# EAGLE schematic CT_Metering_Assignment-V_33_error checked for online (EAGLE 8.2.2)
CT METERING SCHEMATIC
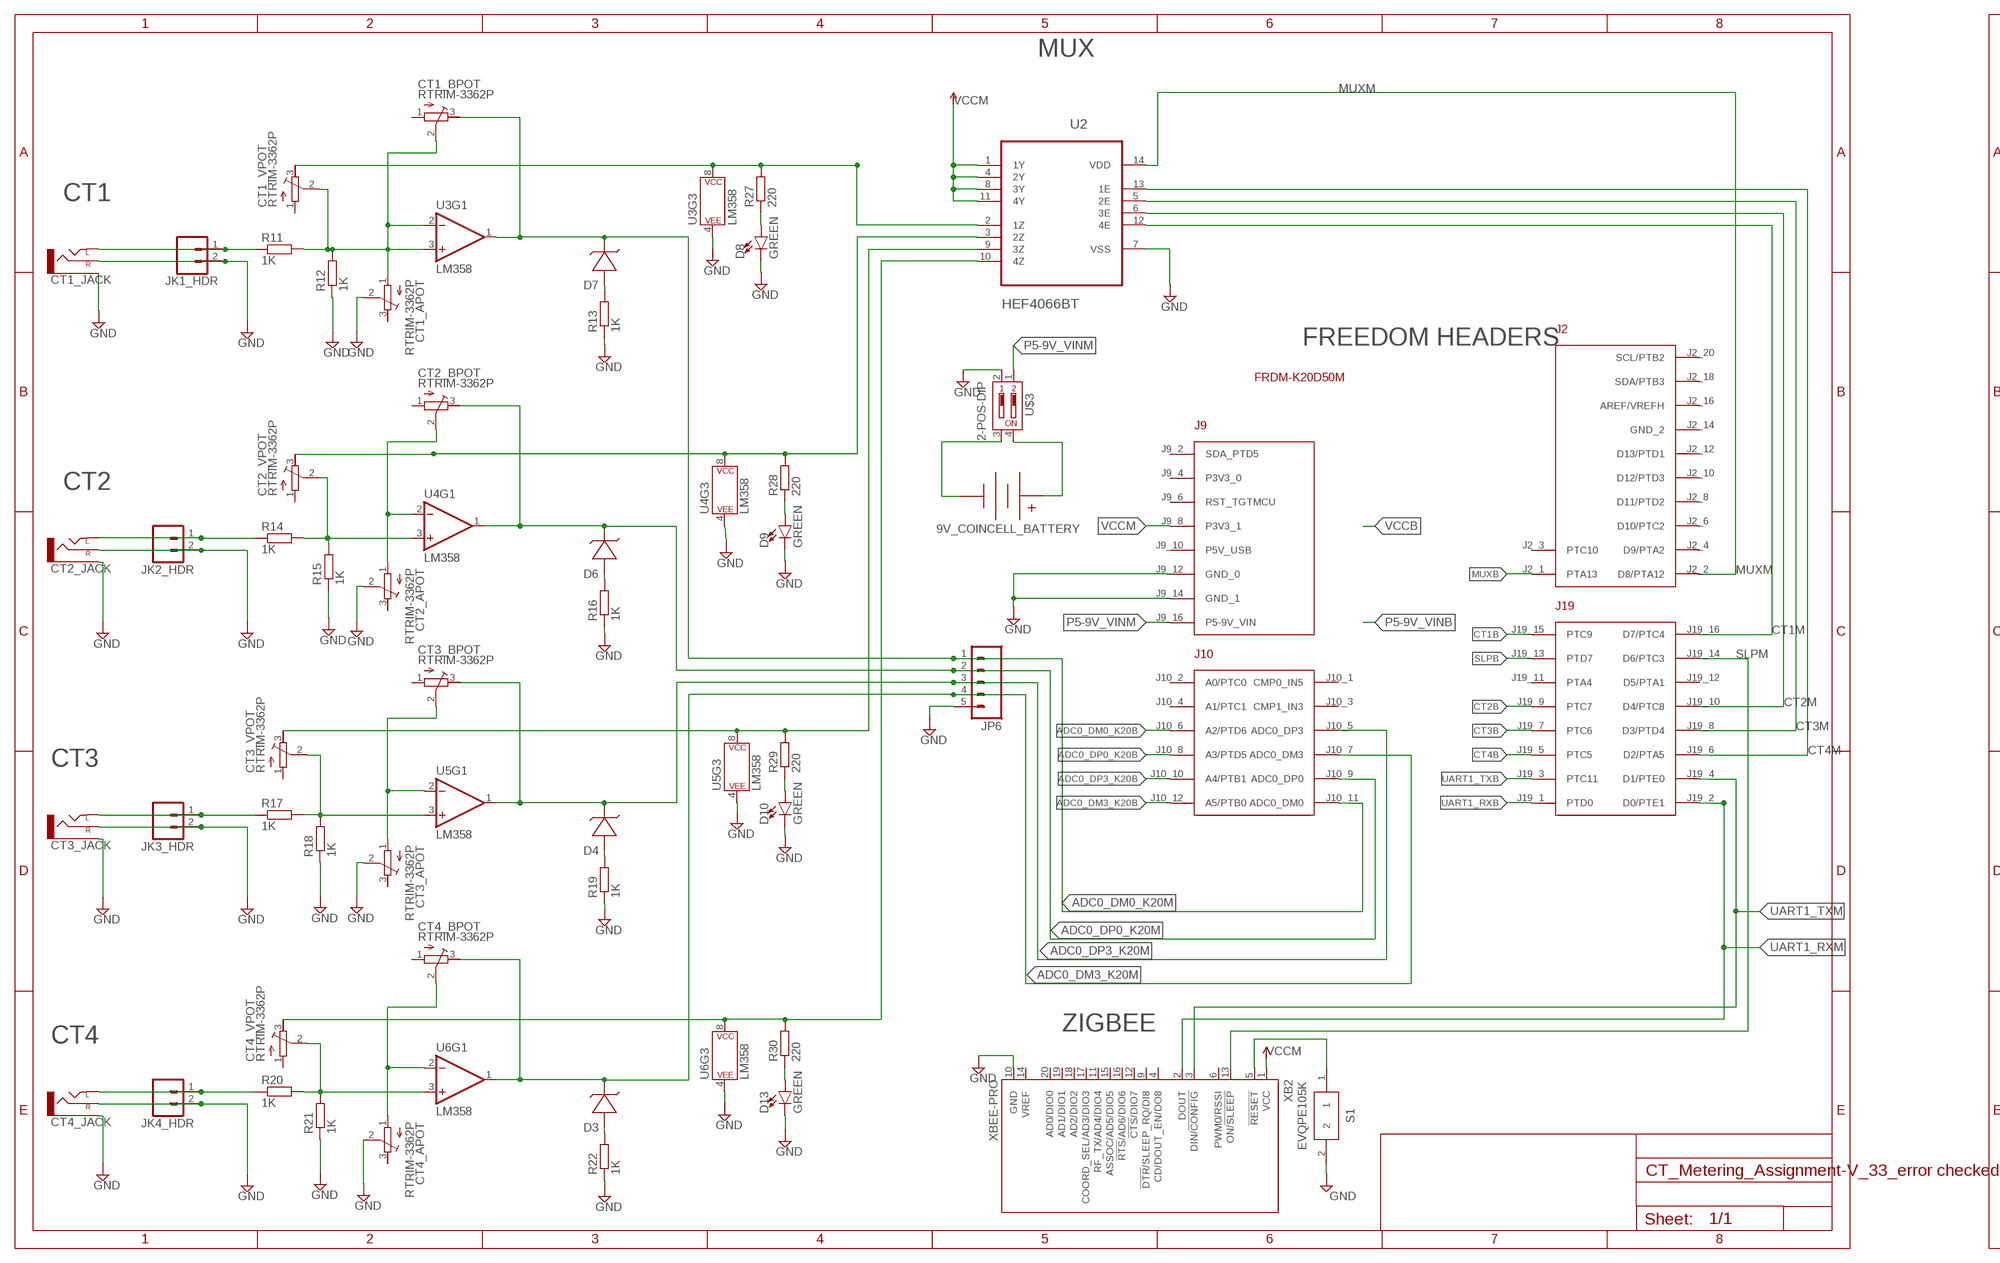
[diagram p0: schematic, sheet 1, part 1 of 2]
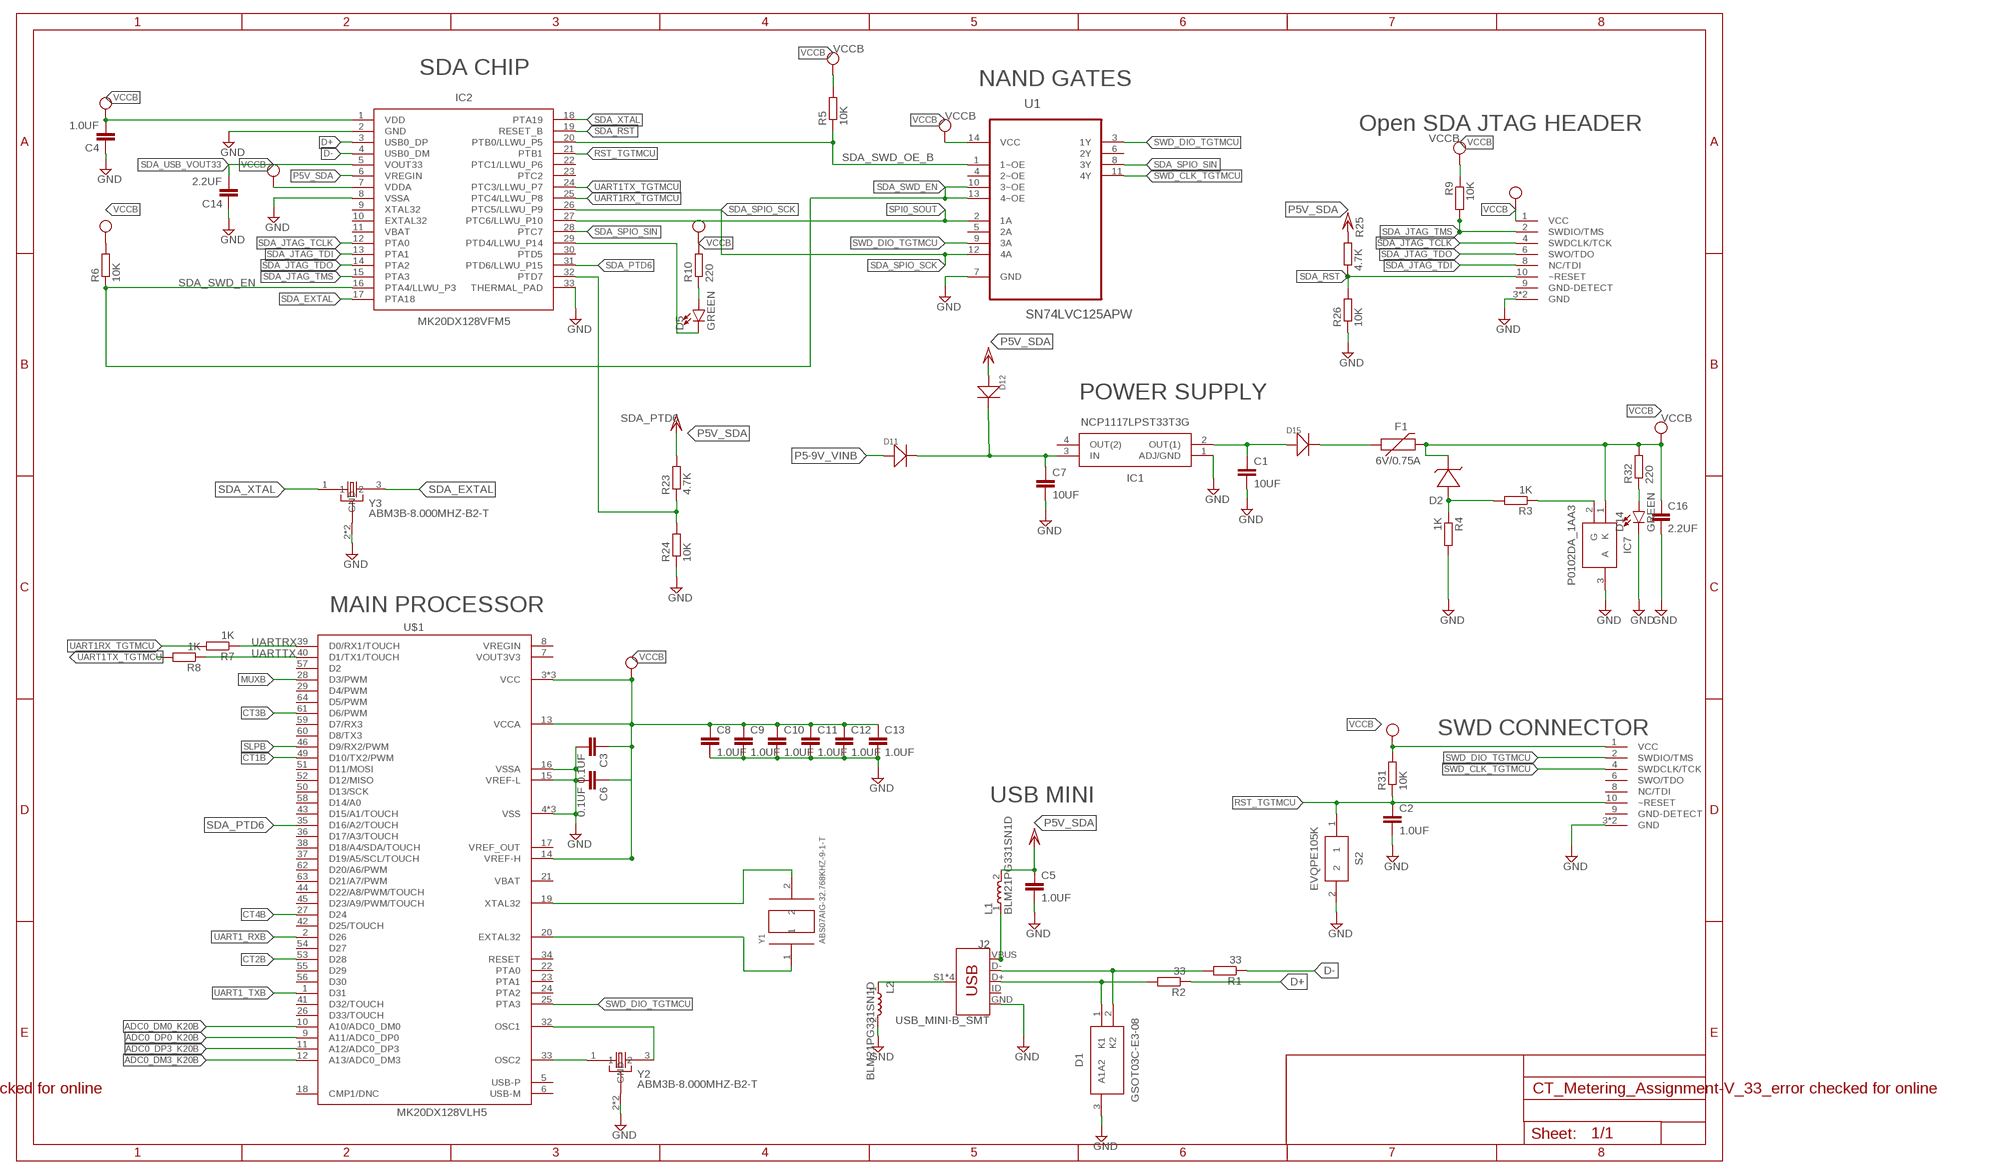
[diagram p1: schematic, sheet 1, part 2 of 2]
U$5 (FRAME-A3-L): AUTHORED: Mick Beans & Clinton

## Parts
9V_COINCELL_BATTERY  BC9VPC  [BC9VPC]
C1  10UF  CC1210  [C1210]
C2  1.0UF  CC1210  [C1210]
C3  0.1UF  CC1210  [C1210]
C4  1.0UF  CC1210  [C1210]
C5  1.0UF  CC1210  [C1210]
C6  0.1UF  CC1210  [C1210]
C7  10UF  CC1210  [C1210]
C8  1.0UF  CC1210  [C1210]
C9  1.0UF  CC1210  [C1210]
C10  1.0UF  CC1210  [C1210]
C11  1.0UF  CC1210  [C1210]
C12  1.0UF  CC1210  [C1210]
C13  1.0UF  CC1210  [C1210]
C14  2.2UF  CC1210  [C1210]
C16  2.2UF  CC1210  [C1210]
CT1_APOT  RTRIM-3362P  [RTRIM3362P]
CT1_BPOT  RTRIM-3362P  [RTRIM3362P]
CT1_JACK  AUDIO-JACKPTH  [AUDIO-JACK]
CT1_VPOT  RTRIM-3362P  [RTRIM3362P]
CT2_APOT  RTRIM-3362P  [RTRIM3362P]
CT2_BPOT  RTRIM-3362P  [RTRIM3362P]
CT2_JACK  AUDIO-JACKPTH  [AUDIO-JACK]
CT2_VPOT  RTRIM-3362P  [RTRIM3362P]
CT3_APOT  RTRIM-3362P  [RTRIM3362P]
CT3_BPOT  RTRIM-3362P  [RTRIM3362P]
CT3_JACK  AUDIO-JACKPTH  [AUDIO-JACK]
CT3_VPOT  RTRIM-3362P  [RTRIM3362P]
CT4_APOT  RTRIM-3362P  [RTRIM3362P]
CT4_BPOT  RTRIM-3362P  [RTRIM3362P]
CT4_JACK  AUDIO-JACKPTH  [AUDIO-JACK]
CT4_VPOT  RTRIM-3362P  [RTRIM3362P]
D1  GSOT03C-E3-08  [SOT100P248X115-3N]
D2  ZENER  [SOD123]
D3  ZENER  [SOD123]
D4  ZENER  [SOD123]
D5  GREEN  LED-GREEN0603  [LED-0603]
D6  ZENER  [SOD123]
D7  ZENER  [SOD123]
D8  GREEN  LED-GREEN0603  [LED-0603]
D9  GREEN  LED-GREEN0603  [LED-0603]
D10  GREEN  LED-GREEN0603  [LED-0603]
D11  20V-1A  SMD-DIODE-SCHOTTKY-20V-1A(SOD-123)  [SOD-123]
D12  20V-1A  SMD-DIODE-SCHOTTKY-20V-1A(SOD-123)  [SOD-123]
D13  GREEN  LED-GREEN0603  [LED-0603]
D14  GREEN  LED-GREEN0603  [LED-0603]
D15  20V-1A  SMD-DIODE-SCHOTTKY-20V-1A(SOD-123)  [SOD-123]
F1  6V/0.75A  PPTC_THREE-QUARTER-AMP  [1206]
FRDM1  FRDM-K20D50M  [FRDM-K20D50M]
IC1  NCP1117LPST33T3G  [SOT230P700X180-4N]
IC2  MK20DX128VFM5  [SOT617-14]
IC7  P0102DA_1AA3  [TO-92]
J2  USB_MINI-B_SMT  [USB-MINIB]
JK1_HDR  M02PTH  [1X02]
JK2_HDR  M02PTH  [1X02]
JK3_HDR  M02PTH  [1X02]
JK4_HDR  M02PTH  [1X02]
JP6  M05PTH  [1X05]
L1  BLM21PG331SN1D  [INDC2012X87]
L2  BLM21PG331SN1D  [INDC2012X87]
R1  33  R-EU_PRL1632  [PRL1632]
R2  33  R-EU_PRL1632  [PRL1632]
R3  1K  R-EU_PRL1632  [PRL1632]
R4  1K  R-EU_PRL1632  [PRL1632]
R5  10K  R-EU_PRL1632  [PRL1632]
R6  10K  R-EU_PRL1632  [PRL1632]
R7  1K  R-EU_PRL1632  [PRL1632]
R8  1K  R-EU_PRL1632  [PRL1632]
R9  10K  R-EU_PRL1632  [PRL1632]
R10  220  R-EU_PRL1632  [PRL1632]
R11  1K  R-EU_PRL1632  [PRL1632]
R12  1K  R-EU_PRL1632  [PRL1632]
R13  1K  R-EU_PRL1632  [PRL1632]
R14  1K  R-EU_PRL1632  [PRL1632]
R15  1K  R-EU_PRL1632  [PRL1632]
R16  1K  R-EU_PRL1632  [PRL1632]
R17  1K  R-EU_PRL1632  [PRL1632]
R18  1K  R-EU_PRL1632  [PRL1632]
R19  1K  R-EU_PRL1632  [PRL1632]
R20  1K  R-EU_PRL1632  [PRL1632]
R21  1K  R-EU_PRL1632  [PRL1632]
R22  1K  R-EU_PRL1632  [PRL1632]
R23  4.7K  R-EU_PRL1632  [PRL1632]
R24  10K  R-EU_PRL1632  [PRL1632]
R25  4.7K  R-EU_PRL1632  [PRL1632]
R26  10K  R-EU_PRL1632  [PRL1632]
R27  220  R-EU_PRL1632  [PRL1632]
R28  220  R-EU_PRL1632  [PRL1632]
R29  220  R-EU_PRL1632  [PRL1632]
R30  220  R-EU_PRL1632  [PRL1632]
R31  10K  R-EU_PRL1632  [PRL1632]
R32  220  R-EU_PRL1632  [PRL1632]
S1  EVQPE105K  [EVQPE1]
S2  EVQPE105K  [EVQPE1]
U1  SN74LVC125APW  [SOP65P640X120-14N]
U2  HEF4066BT  [SOIC127P600X175-14N]
U3  LM358  [DIP08]
U4  LM358  [DIP08]
U5  LM358  [DIP08]
U6  LM358  [DIP08]
U$1  MK20DX128VLH5  [QFP50P1200X1200X160-64N]
U$2  2X5_0.05"_CORTEX_DEBUGTH_NOKEY_UNSHROUDED  [2X5_0.05"_TH_NS]
U$3  2-POS-DIP  [CHS-02A]
U$6  SWD HHEADER  2X5_0.05"_CORTEX_DEBUGTH_NOKEY_UNSHROUDED  [2X5_0.05"_TH_NS]
XB2  XBEE-PRO  [XBEE-PRO]
Y1  ABS07AIG-32.768KHZ-9-1-T  [XTAL320X150X90]
Y2  ABM3B-8.000MHZ-B2-T  [OSCSC500X320X110-4N]
Y3  ABM3B-8.000MHZ-B2-T  [OSCSC500X320X110-4N]

## Nets
ADC0_DM0_K20B: FRDM1.J10_6(A2/PTD6) U$1.10(A10/ADC0_DM0)
ADC0_DM0_K20M: CT1_BPOT.3 D7.C(-) FRDM1.J10_11(ADC0_DM0) JP6.1 U3.1(OUT)
ADC0_DM3_K20B: FRDM1.J10_12(A5/PTB0) U$1.12(A13/ADC0_DM3)
ADC0_DM3_K20M: CT4_BPOT.3 D3.C(-) FRDM1.J10_7(ADC0_DM3) JP6.4 U6.1(OUT)
ADC0_DP0_K20B: FRDM1.J10_8(A3/PTD5) U$1.9(A11/ADC0_DP0)
ADC0_DP0_K20M: CT2_BPOT.3 D6.C(-) FRDM1.J10_9(ADC0_DP0) JP6.2 U4.1(OUT)
ADC0_DP3_K20B: FRDM1.J10_10(A4/PTB1) U$1.11(A12/ADC0_DP3)
ADC0_DP3_K20M: CT3_BPOT.3 D4.C(-) FRDM1.J10_5(ADC0_DP3) JP6.3 U5.1(OUT)
CT1_PWR: CT1_VPOT.3 R27.2 U2.2(1Z) U3.8(P$V+)
CT1B: FRDM1.J19_15(PTC9) U$1.49(D10/TX2/PWM)
CT1M: FRDM1.J19_16(D7/PTC4) U2.12(4E)
CT2_PWR: CT2_VPOT.3 R28.2 U2.3(2Z) U4.8(P$V+)
CT2B: FRDM1.J19_9(PTC7) U$1.53(D28)
CT2M: FRDM1.J19_10(D4/PTC8) U2.6(3E)
CT3_PWR: CT3_VPOT.3 R29.2 U2.9(3Z) U5.8(P$V+)
CT3B: FRDM1.J19_7(PTC6) U$1.61(D6/PWM)
CT3M: FRDM1.J19_8(D3/PTD4) U2.5(2E)
CT4_PWR: CT4_VPOT.3 R30.2 U2.10(4Z) U6.8(P$V+)
CT4B: FRDM1.J19_5(PTC5) U$1.27(D24)
CT4M: FRDM1.J19_6(D2/PTA5) U2.13(1E)
D+: IC2.3(USB0_DP) R2.1
D-: IC2.4(USB0_DM) R1.1
EXTAL32: U$1.20(EXTAL32) Y1.1
GND: C1.2 C2.2 C3.2 C4.1 C5.2 C6.2 C7.2 C8.2 C9.2 C10.2 C11.2 C12.2 C13.2 C14.1 C16.2 CT1_APOT.2 CT1_JACK.RING(RIGHT) CT1_JACK.SLEEVE CT2_APOT.2 CT2_JACK.RING(RIGHT) CT2_JACK.SLEEVE CT3_APOT.2 CT3_JACK.RING(RIGHT) CT3_JACK.SLEEVE CT4_APOT.2 CT4_JACK.RING(RIGHT) CT4_JACK.SLEEVE D1.3(A1A2) D8.C D9.C D10.C D13.C D14.C FRDM1.J9_12(GND_0) FRDM1.J9_14(GND_1) IC1.1(ADJ/GND) IC2.2(GND) IC2.8(VSSA) IC2.33(THERMAL_PAD) IC7.3(A) J2.GND JK1_HDR.2 JK2_HDR.2 JK3_HDR.2 JK4_HDR.2 JP6.5 L2.2 R4.2 R12.1 R13.1 R15.1 R16.1 R18.1 R19.1 R21.1 R22.1 R24.1 R26.1 S1.2 S2.2 U1.7(GND) U2.7(VSS) U3.4(P$V-) U4.4(P$V-) U5.4(P$V-) U6.4(P$V-) U$1.4(VSS) U$1.15(VREF-L) U$1.16(VSSA) U$1.31(VSS) U$1.47(VSS) U$2.3(GND) U$2.5(GND) U$3.2 U$6.3(GND) U$6.5(GND) XB2.10(GND) Y2.2(GND) Y2.4(GND) Y3.2(GND) Y3.4(GND)
MUXB: FRDM1.J2_1(PTA13) U$1.28(D3/PWM)
MUXM: FRDM1.J2_2(D8/PTA12) U2.14(VDD)
N$1: 9V_COINCELL_BATTERY.V- U$3.3
N$2: C1.1 D15.+ IC1.2(OUT(1))
N$3: D6.A(+) R16.2
N$4: D15.- F1.1
N$5: D2.A(+) R3.2 R4.1
N$6: D7.A(+) R13.2
N$7: U$1.32(OSC1) Y2.3
N$8: U$1.33(OSC2) Y2.1
N$9: J2.S1(SHIELD) J2.S2(SHIELD) J2.S3(SHIELD) J2.S4(SHIELD) L2.1
N$10: D4.A(+) R19.2
N$11: CT2_VPOT.2 R14.2 R15.2 U4.3(+IN)
N$12: 9V_COINCELL_BATTERY.V+ U$3.4
N$13: C7.1 D11.- D12.- IC1.3(IN)
N$14: D8.A R27.1
N$15: D1.2(K2) J2.D- R1.2
N$16: IC7.2(G) R3.1
N$17: CT4_APOT.1 CT4_BPOT.2 U6.2(-IN)
N$18: D9.A R28.1
N$19: D3.A(+) R22.2
N$20: D1.1(K1) J2.D+ R2.2
N$21: D5.C IC2.29(PTD4/LLWU_P14)
N$22: D5.A R10.1
N$23: D10.A R29.1
N$24: S1.1 XB2.5(!RESET)
N$25: D13.A R30.1
N$26: CT1_APOT.1 CT1_BPOT.2 CT1_VPOT.2 R11.2 R12.2 U3.2(-IN) U3.3(+IN)
N$27: D14.A R32.1
N$36: CT2_JACK.TIP(LEFT) JK2_HDR.1 R14.1
N$42: CT2_APOT.1 CT2_BPOT.2 U4.2(-IN)
N$58: CT1_JACK.TIP(LEFT) JK1_HDR.1 R11.1
N$59: IC2.32(PTD7) R23.1 R24.2
N$66: CT3_JACK.TIP(LEFT) JK3_HDR.1 R17.1
N$67: CT3_VPOT.2 R17.2 R18.2 U5.3(+IN)
N$70: CT3_APOT.1 CT3_BPOT.2 U5.2(-IN)
N$76: CT4_JACK.TIP(LEFT) JK4_HDR.1 R20.1
N$77: CT4_VPOT.2 R20.2 R21.2 U6.3(+IN)
P5-9V_VINB: D11.+
P5-9V_VINM: FRDM1.J9_16(P5-9V_VIN) U$3.1
P5V0_SDA_USB: J2.VBUS L1.1
P5V_SDA: C5.1 D12.+ IC2.6(VREGIN) L1.2 R23.2 R25.2 ; supply symbol labelled VCC/2
RST_TGTMCU: C2.1 IC2.21(PTB1) R31.1 S2.1 U$6.10(~RESET)
SDA_EXTAL: IC2.17(PTA18) Y3.3
SDA_JTAG_TCLK: IC2.12(PTA0) U$2.4(SWDCLK/TCK)
SDA_JTAG_TDI: IC2.13(PTA1) U$2.8(NC/TDI)
SDA_JTAG_TDO: IC2.14(PTA2) U$2.6(SWO/TDO)
SDA_JTAG_TMS: IC2.15(PTA3) R9.2 U$2.2(SWDIO/TMS)
SDA_PTD6: IC2.31(PTD6/LLWU_P15) U$1.35(D16/A2/TOUCH)
SDA_RST: IC2.19(RESET_B) R25.1 R26.2 U$2.10(~RESET)
SDA_SPIO_SCK: IC2.26(PTC5/LLWU_P9) U1.12(4A)
SDA_SPIO_SIN: IC2.28(PTC7) U1.8(3Y)
SDA_SWD_EN: IC2.16(PTA4/LLWU_P3) R6.1 U1.10(3~OE) U1.13(4~OE)
SDA_SWD_OE_B: IC2.20(PTB0/LLWU_P5) R5.1 U1.1(1~OE)
SDA_USB_VOUT33: C14.2 IC2.5(VOUT33)
SDA_XTAL: IC2.18(PTA19) Y3.1
SLPB: FRDM1.J19_13(PTD7) U$1.46(D9/RX2/PWM)
SLPM: FRDM1.J19_14(D6/PTC3) XB2.13(ON/!SLEEP)
SPI0_SOUT: IC2.27(PTC6/LLWU_P10) U1.2(1A)
SWD_CLK_TGTMCU: U1.11(4Y) U$6.4(SWDCLK/TCK)
SWD_DIO_TGTMCU: U1.3(1Y) U1.9(3A) U$1.25(PTA3) U$6.2(SWDIO/TMS)
UART1_RXB: FRDM1.J19_1(PTD0) U$1.2(D26)
UART1_RXM: FRDM1.J19_2(D0/PTE1) XB2.2(DOUT)
UART1_TXB: FRDM1.J19_3(PTC11) U$1.1(D31)
UART1_TXM: FRDM1.J19_4(D1/PTE0) XB2.3(DIN/!CONFIG)
UART1RX_TGTMCU: IC2.25(PTC4/LLWU_P8) R7.2
UART1TX_TGTMCU: IC2.24(PTC3/LLWU_P7) R8.2
UARTRX: R7.1 U$1.39(D0/RX1/TOUCH)
UARTTX: R8.1 U$1.40(D1/TX1/TOUCH)
VCCB: C3.1 C4.2 C6.1 C8.1 C9.1 C10.1 C11.1 C12.1 C13.1 C16.1 D2.C(-) F1.2 IC2.1(VDD) IC2.7(VDDA) IC7.1(K) R5.2 R6.2 R9.1 R10.2 R31.2 R32.2 U1.14(VCC) U$1.3(VCC) U$1.13(VCCA) U$1.14(VREF-H) U$1.30(VCC) U$1.48(VCC) U$2.1(VCC) U$6.1(VCC) ; supply symbol labelled VCC
VCCM: FRDM1.J9_8(P3V3_1) U2.1(1Y) U2.4(2Y) U2.8(3Y) U2.11(4Y) XB2.1(VCC) ; supply symbol labelled VCC_1
XTAL32: U$1.19(XTAL32) Y1.2
Unconnected: CT1_APOT.3 CT1_BPOT.1 CT1_VPOT.1 CT2_APOT.3 CT2_BPOT.1 CT2_VPOT.1 CT3_APOT.3 CT3_BPOT.1 CT3_VPOT.1 CT4_APOT.3 CT4_BPOT.1 CT4_VPOT.1 FRDM1.J2_3(PTC10) FRDM1.J2_4(D9/PTA2) FRDM1.J2_6(D10/PTC2) FRDM1.J2_8(D11/PTD2) FRDM1.J2_10(D12/PTD3) FRDM1.J2_12(D13/PTD1) FRDM1.J2_14(GND_2) FRDM1.J2_16(AREF/VREFH) FRDM1.J2_18(SDA/PTB3) FRDM1.J2_20(SCL/PTB2) FRDM1.J9_2(SDA_PTD5) FRDM1.J9_4(P3V3_0) FRDM1.J9_6(RST_TGTMCU) FRDM1.J9_10(P5V_USB) FRDM1.J10_1(CMP0_IN5) FRDM1.J10_2(A0/PTC0) FRDM1.J10_3(CMP1_IN3) FRDM1.J10_4(A1/PTC1) FRDM1.J19_11(PTA4) FRDM1.J19_12(D5/PTA1) IC1.4(OUT(2)) IC2.9(XTAL32) IC2.10(EXTAL32) IC2.11(VBAT) IC2.22(PTC1/LLWU_P6) IC2.23(PTC2) IC2.30(PTD5) J2.ID U1.4(2~OE) U1.5(2A) U1.6(2Y) U3.5(+IN) U3.6(-IN) U3.7(OUT) U4.5(+IN) U4.6(-IN) U4.7(OUT) U5.5(+IN) U5.6(-IN) U5.7(OUT) U6.5(+IN) U6.6(-IN) U6.7(OUT) U$1.5(USB-P) U$1.6(USB-M) U$1.7(VOUT3V3) U$1.8(VREGIN) U$1.17(VREF_OUT) U$1.18(CMP1/DNC) U$1.21(VBAT) U$1.22(PTA0) U$1.23(PTA1) U$1.24(PTA2) U$1.26(D33/TOUCH) U$1.29(D4/PWM) U$1.34(RESET) U$1.36(D17/A3/TOUCH) U$1.37(D19/A5/SCL/TOUCH) U$1.38(D18/A4/SDA/TOUCH) U$1.41(D32/TOUCH) U$1.42(D25/TOUCH) U$1.43(D15/A1/TOUCH) U$1.44(D22/A8/PWM/TOUCH) U$1.45(D23/A9/PWM/TOUCH) U$1.50(D13/SCK) U$1.51(D11/MOSI) U$1.52(D12/MISO) U$1.54(D27) U$1.55(D29) U$1.56(D30) U$1.57(D2) U$1.58(D14/A0) U$1.59(D7/RX3) U$1.60(D8/TX3) U$1.62(D20/A6/PWM) U$1.63(D21/A7/PWM) U$1.64(D5/PWM) U$2.9(GND-DETECT) U$6.6(SWO/TDO) U$6.8(NC/TDI) U$6.9(GND-DETECT) XB2.4(CD/DOUT_EN/DO8) XB2.6(PWM0/RSSI) XB2.9(!DTR!/SLEEP_RQ/DI8) XB2.11(RF_TX/AD4/DIO4) XB2.12(!CTS!/DIO7) XB2.14(VREF) XB2.15(ASSOC/AD5/DIO5) XB2.16(!RTS!/AD6/DIO6) XB2.17(COORD_SEL/AD3/DIO3) XB2.18(AD2/DIO2) XB2.19(AD1/DIO1) XB2.20(AD0/DIO0)

## Notes on the sheet
- MUX
- SDA CHIP
- NAND GATES
- Open SDA JTAG HEADER
- CT1
- FREEDOM HEADERS
- POWER SUPPLY
- CT2
- MAIN PROCESSOR
- CT3
- SWD CONNECTOR
- USB MINI
- ZIGBEE
- CT4

## Library data of the parts
9V_COINCELL_BATTERY = SparkFun-Connectors:BC9VPC: 9V Battery Holder - PC Mount Standard and Kit footprints included SparkFun Products: SparkFun SparkPunk Sound Kit <https://www.sparkfun.com/products/11177> SparkFun SparkPunk Sequencer Kit <https://www.sparkfun.com/products/12707>; PROD_ID: BATT-10855
C1-C14 C16 = eagle-ltspice:C: CAPACITOR, European symbol; SPICEMODEL: NONE; SPICEPREFIX: C
CT1_APOT CT1_BPOT CT1_VPOT CT2_APOT CT2_BPOT CT2_VPOT CT3_APOT CT3_BPOT CT3_VPOT CT4_APOT CT4_BPOT CT4_VPOT = GeekAmmo:RTRIM: BOURNS 3362 - 1/4" Square Trimpot® Trimming Potentiometer
CT1_JACK CT2_JACK CT3_JACK CT4_JACK = SparkFun-Connectors:AUDIO-JACK: 3.5mm Audio Jack Simple 3.5mm common PCB mount audio jack. Variant PTH is our storefront SKU PRT-08032
D1 = GSOT03C-E3-08:GSOT03C-E3-08: Bidirectional TVS Single 504W 3.3V SOT23 Vishay GSOT03C-E3-08, Bi-Directional TVS Diode Common Anode, Dual, 12.3V, 504W, 3-Pin SOT-23 <https://componentsearchengine.com/Images/3/GSOT03C-E3-08.jpg> Source: Datasheet <http://docs-europe.electrocomponents.com/webdocs/13f3/0900766b813f3162.pdf>; ALLIED_NUMBER: 70061865; DESCRIPTION: Bidirectional TVS Single 504W 3.3V SOT23 Vishay GSOT03C-E3-08, Bi-Directional TVS Diode Common Anode, Dual, 12.3V, 504W, 3-Pin SOT-23; HEIGHT: 1.15mm; MANUFACTURER_NAME: Vishay; MANUFACTURER_PART_NUMBER: GSOT03C-E3-08; RS_PART_NUMBER: 6997957; SUPPLIER_NAME: RS
D2-D4 D6 D7 = sym:ZENER: Zener Diode
D5 D8-D10 D13 D14 = SparkFun-LED:LED-GREEN: Green SMD LED Used in manufacturing of various products at SparkFun Packages: 0603 - SMD 0603 package [Product Link] <http://www.futureelectronics.com/en/technologies/semiconductors/optoelectronics/leds/Pages/9894312-LTST-C190GKT.aspx?CrossPart=HSMG-C190&IM=0> LilyPad 1206 - SMD1206 LilyPad package [Product Link] <http://www.futureelectronics.com/en/Technologies/Product.aspx?ProductID=IN150NGHARVATEKCORPORATION2049943&IM=0> 1206 - SMD1206 package [Product Link] <http://www.futureelectronics.com/en/technologies/semiconductors/optoelectronics/leds/Pages/8315665-LTST-C150KGKT.aspx?IM=0> 1206 Bottom Mount -SMD 1206 Bottom Mount [Product Link] <http://www.digikey.com/product-detail/en/lite-on-inc/LTST-C230KGKT/160-1456-1-ND/386854> SparkFun Products: Pro Mini 328 -5V <https://www.sparkfun.com/products/821> RedBoard <https://www.sparkfun.com/products/12757> MP3 Trigger <https://www.sparkfun.com/products/13720> Makey Makey <https://www.sparkfun.com/products/11076>; PROD_ID: DIO-00821
D11 D12 D15 = Seeed-Diode:SMD-DIODE-SCHOTTKY-20V-1A(SOD-123): 304020034; MPN: B5819W
F1 = SparkFun-Fuses:PPTC: Resettable Fuse PPTC Resettable Fuse. Really a sort of resistor with a polymeric positive temperature coefficient whose resistance increases dramatically with an increase in temperature. When heated by the power passing through the resistance rises causing the current to be limited, protecting the circuit. This is achieved by the transition of the polymer from a crystalline to an amorphous state where the conductive carbon separates breaking the conductive pathways found in the cool crystalline structure. When a PPTC cools back down it resumes conducting letting the circuit turn back on. SparkFun Products: SparkFun RedBoard - Programmed with Arduino <https://www.sparkfun.com/products/12757> Pro Micro - 5V/16MHz <https://www.sparkfun.com/products/12640> Arduino Pro 328 - 5V/16MHz <https://www.sparkfun.com/products/10915> MP3 Trigger <https://www.sparkfun.com/products/13720>; PROD_ID: RES-11150
FRDM1 = FRDM-K20D50M:FRDM-K20D50M: For creating FRDM-K20D50M shields
IC1 = NCP1117LPST33T3G:NCP1117LPST33T3G: <https://componentsearchengine.com/Images/3/NCP1117LPST33T3G.jpg> Source: Datasheet <http://www.onsemi.com/pub/Collateral/NCP1117LP-D.PDF>; ALLIED_NUMBER: 70466897; HEIGHT: 1.8mm; MANUFACTURER_NAME: ON Semiconductor; MANUFACTURER_PART_NUMBER: NCP1117LPST33T3G; RS_PART_NUMBER: 1245347; SUPPLIER_NAME: RS
IC2 = MK20DX128VFM5:MK20DX128VFM5: MCU, Kinetis, MK20DX128VFM5, QFN32 Freescale MK20DX128VFM5, 32bit ARM Cortex M4 MCU, 50MHz, 160 kB Flash, 32-Pin QFN <https://componentsearchengine.com/Images/3/MK20DX128VFM5.jpg> Source: Datasheet <http://www.nxp.com/docs/en/data-sheet/K20P32M50SF0.pdf>; DESCRIPTION: MCU, Kinetis, MK20DX128VFM5, QFN32 Freescale MK20DX128VFM5, 32bit ARM Cortex M4 MCU, 50MHz, 160 kB Flash, 32-Pin QFN; HEIGHT: mm; MANUFACTURER_NAME: NXP; MANUFACTURER_PART_NUMBER: MK20DX128VFM5; RS_PART_NUMBER: 8181223; SUPPLIER_NAME: RS
IC7 = P0102DA_1AA3:P0102DA_1AA3: <https://componentsearchengine.com/Images/3/P0102DA+1AA3.jpg> Source: Datasheet <http://www.st.com/web/en/resource/technical/document/datasheet/CD00217834.pdf>; ALLIED_NUMBER: 70390354; HEIGHT: mm; MANUFACTURER_NAME: STMicroelectronics; MANUFACTURER_PART_NUMBER: P0102DA 1AA3; RS_PART_NUMBER: 7142647; SUPPLIER_NAME: RS
J2 = SparkFun-Connectors:USB_MINI-B: USB type Mini-B Connector Breaks out 5th pin, and includes shield pins if needed. SparkFun Products: SparkFun FTDI Basic Breakout <https://www.sparkfun.com/products/9716> SparkFun XBee Explorer USB <https://www.sparkfun.com/products/11812> SparkFun Redboard <https://www.sparkfun.com/products/12757>; PROD_ID: CONN-08193; SF_ID: PRT-00587
JK1_HDR JK2_HDR JK3_HDR JK4_HDR = SparkFun-Connectors:M02: Standard 2-pin 0.1" header. Use with - straight break away headers ( PRT-00116) - right angle break away headers (PRT-00553) - swiss pins (PRT-00743) - machine pins (PRT-00117) - female headers (PRT-00115) Molex polarized connector foot print use with: PRT-08233 with associated crimp pins and housings. 2.54_SCREWTERM for use with PRT-10571. 3.5mm Screw Terminal footprints for PRT-08084 5mm Screw Terminal footprints for use with PRT-08432
JP6 = SparkFun-Connectors:M05: Header 5 Standard 5-pin 0.1" header. Use with straight break away headers (SKU : PRT-00116), right angle break away headers (PRT-00553), swiss pins (PRT-00743), machine pins (PRT-00117), and female headers (PRT-00115). Molex polarized connector foot print use with SKU : PRT-08230 with associated crimp pins and housings.
L1 L2 = BLM21PG331SN1D:BLM21PG331SN1D: Ferrite Beads Multi-Layer 330Ohm 25% 100MHz 1.5A 70mOhm DCR 0805 Paper T/R; AVAILABILITY: Good; DESCRIPTION: Ferrite Beads Multi-Layer 330Ohm 25%25 100MHz 1.5A 70mOhm DCR 0805 Paper T/R; MF: Murata; MP: BLM21PG331SN1D; PACKAGE: 0805 Murata; PRICE: 0.04 USD
R1-R32 = resistor:R-EU_: RESISTOR, European symbol
S1 S2 = EVQPE105K:EVQPE105K: Tact switch,SMT,SPST,black,1.0N op force Black Push Plate Tactile Switch, SPST-NO 50 mA 5mm <https://componentsearchengine.com/Images/3/EVQPE105K.jpg> Source: Datasheet <http://uk.rs-online.com/web/p/products/7561669>; DESCRIPTION: Tact switch,SMT,SPST,black,1.0N op force Black Push Plate Tactile Switch, SPST-NO 50 mA 5mm; HEIGHT: mm; MANUFACTURER_NAME: Panasonic; MANUFACTURER_PART_NUMBER: EVQPE105K; RS_PART_NUMBER: 7561669; SUPPLIER_NAME: RS
U1 = SN74LVC125APW:SN74LVC125APW: QUADRUPLE BUS BUFFER GATE WITH 3-STATE OUTPUTS; AVAILABILITY: Good; DESCRIPTION: Buffer-line Driver 4 Channel Non-Inverting 3 State CMOS 14-Pin TSSOP Tube; MF: Texas Instruments; MP: SN74LVC125APW; PACKAGE: TSSOP-14 Texas Instruments; PRICE: 0.22 USD
U2 = HEF4066BT:HEF4066BT: Quad single-pole single-throw analog switch; AVAILABILITY: Good; DESCRIPTION: Analog Switch Quad SPST Automotive 14-Pin SO; MF: NXP Semiconductors; MP: HEF4066BT; PACKAGE: SO-14 NXP Semiconductors; PRICE: 0.21 USD
U3-U6 = SparkFun-IC-Amplifiers:LM358: LM358 Jellybean op-amp Datasheet <http://www.sparkfun.com/datasheets/Components/General/LM358.pdf> SparkFun Products Op-Amp (Thru-Hole) - LM358 <https://www.sparkfun.com/products/9456> (COM-09456); PROD_ID: IC-09172
U$1 = MK20DX128VLH5:MK20DX128VLH5: This is a pin mapping for the MK20DX128VLH5 processor used on the Teensy 3.00 with the Teensy pin mappings. Remember, if you want to use USB, VOut3v3 has to be attached to the 3.3V bus.; AVAILABILITY: Good; DESCRIPTION: MCU 32-bit Kinetis K20 ARM Cortex M4 RISC 128KB Flash 1.8V/2.5V/3.3V 64-Pin LQFP Tray; MF: NXP Semiconductors; MP: MK20DX128VLH5; PACKAGE: LQFP-64 NXP Semiconductors; PRICE: 4.22 USD
U$2 U$6 = con-cortex:2X5_0.05"_CORTEX_DEBUG
U$3 = SparkFun-Electromechanical:2-POS-DIP: SMD dip switch 2 positions; PROD_ID: SWCH-12372
XB2 = maxstream:XBEE: XBee (TM) /XBee-PRO(TM) OEM RF Modules Source: MaxStream, Inc. xbee_productmanual.pdf; MPN: XBP24-AWI-001; OC_FARNELL: 1337916; OC_NEWARK: 42M2667
Y1 = ABS07AIG-32.768KHZ-9-1-T:ABS07AIG-32.768KHZ-9-1-T: ABS07 Series 32.768 kHz ±20 ppm 12.5 pF -40 to +85 C SMT Low Profile Crystal; AVAILABILITY: Good; DESCRIPTION: Crystal 32.768khz 9pf Smd; MF: Abracon; MP: ABS07AIG-32.768KHZ-9-1-T; PACKAGE: SMD-2 Abracon; PRICE: 0.53 USD
Y2 Y3 = ABM3B-8.000MHZ-B2-T:ABM3B-8.000MHZ-B2-T: Crystal 8MHz ±20ppm (Tol) ±50ppm (Stability) 18pF FUND 200Ohm 4-Pin CSMD T/R; AVAILABILITY: Good; DESCRIPTION: Crystal 8MHz %C2%B120ppm %28Tol%29 %C2%B150ppm %28Stability%29 18pF FUND 200Ohm 4-Pin CSMD T/R; MF: Abracon; MP: ABM3B-8.000MHZ-B2-T; PACKAGE: SMD-4 Abracon; PRICE: 0.44 USD